# EasyEDA Pro project ProDoc_WCH-LinkW-R0-1v3_2025-07-17.epro

# Schematic WCH-LinkW-R0-1v3
Board Name: WCH-LinkW-R0-1v3; Create Date: 2025-03-27; Page Name: P1; Project Name: WCH_LINK; Schematic Name: WCH-LinkW-R0-1v2_1; Update Date: 2025-03-27; Company: 嘉立创EDA; Page Size: A3; Version: V1.0
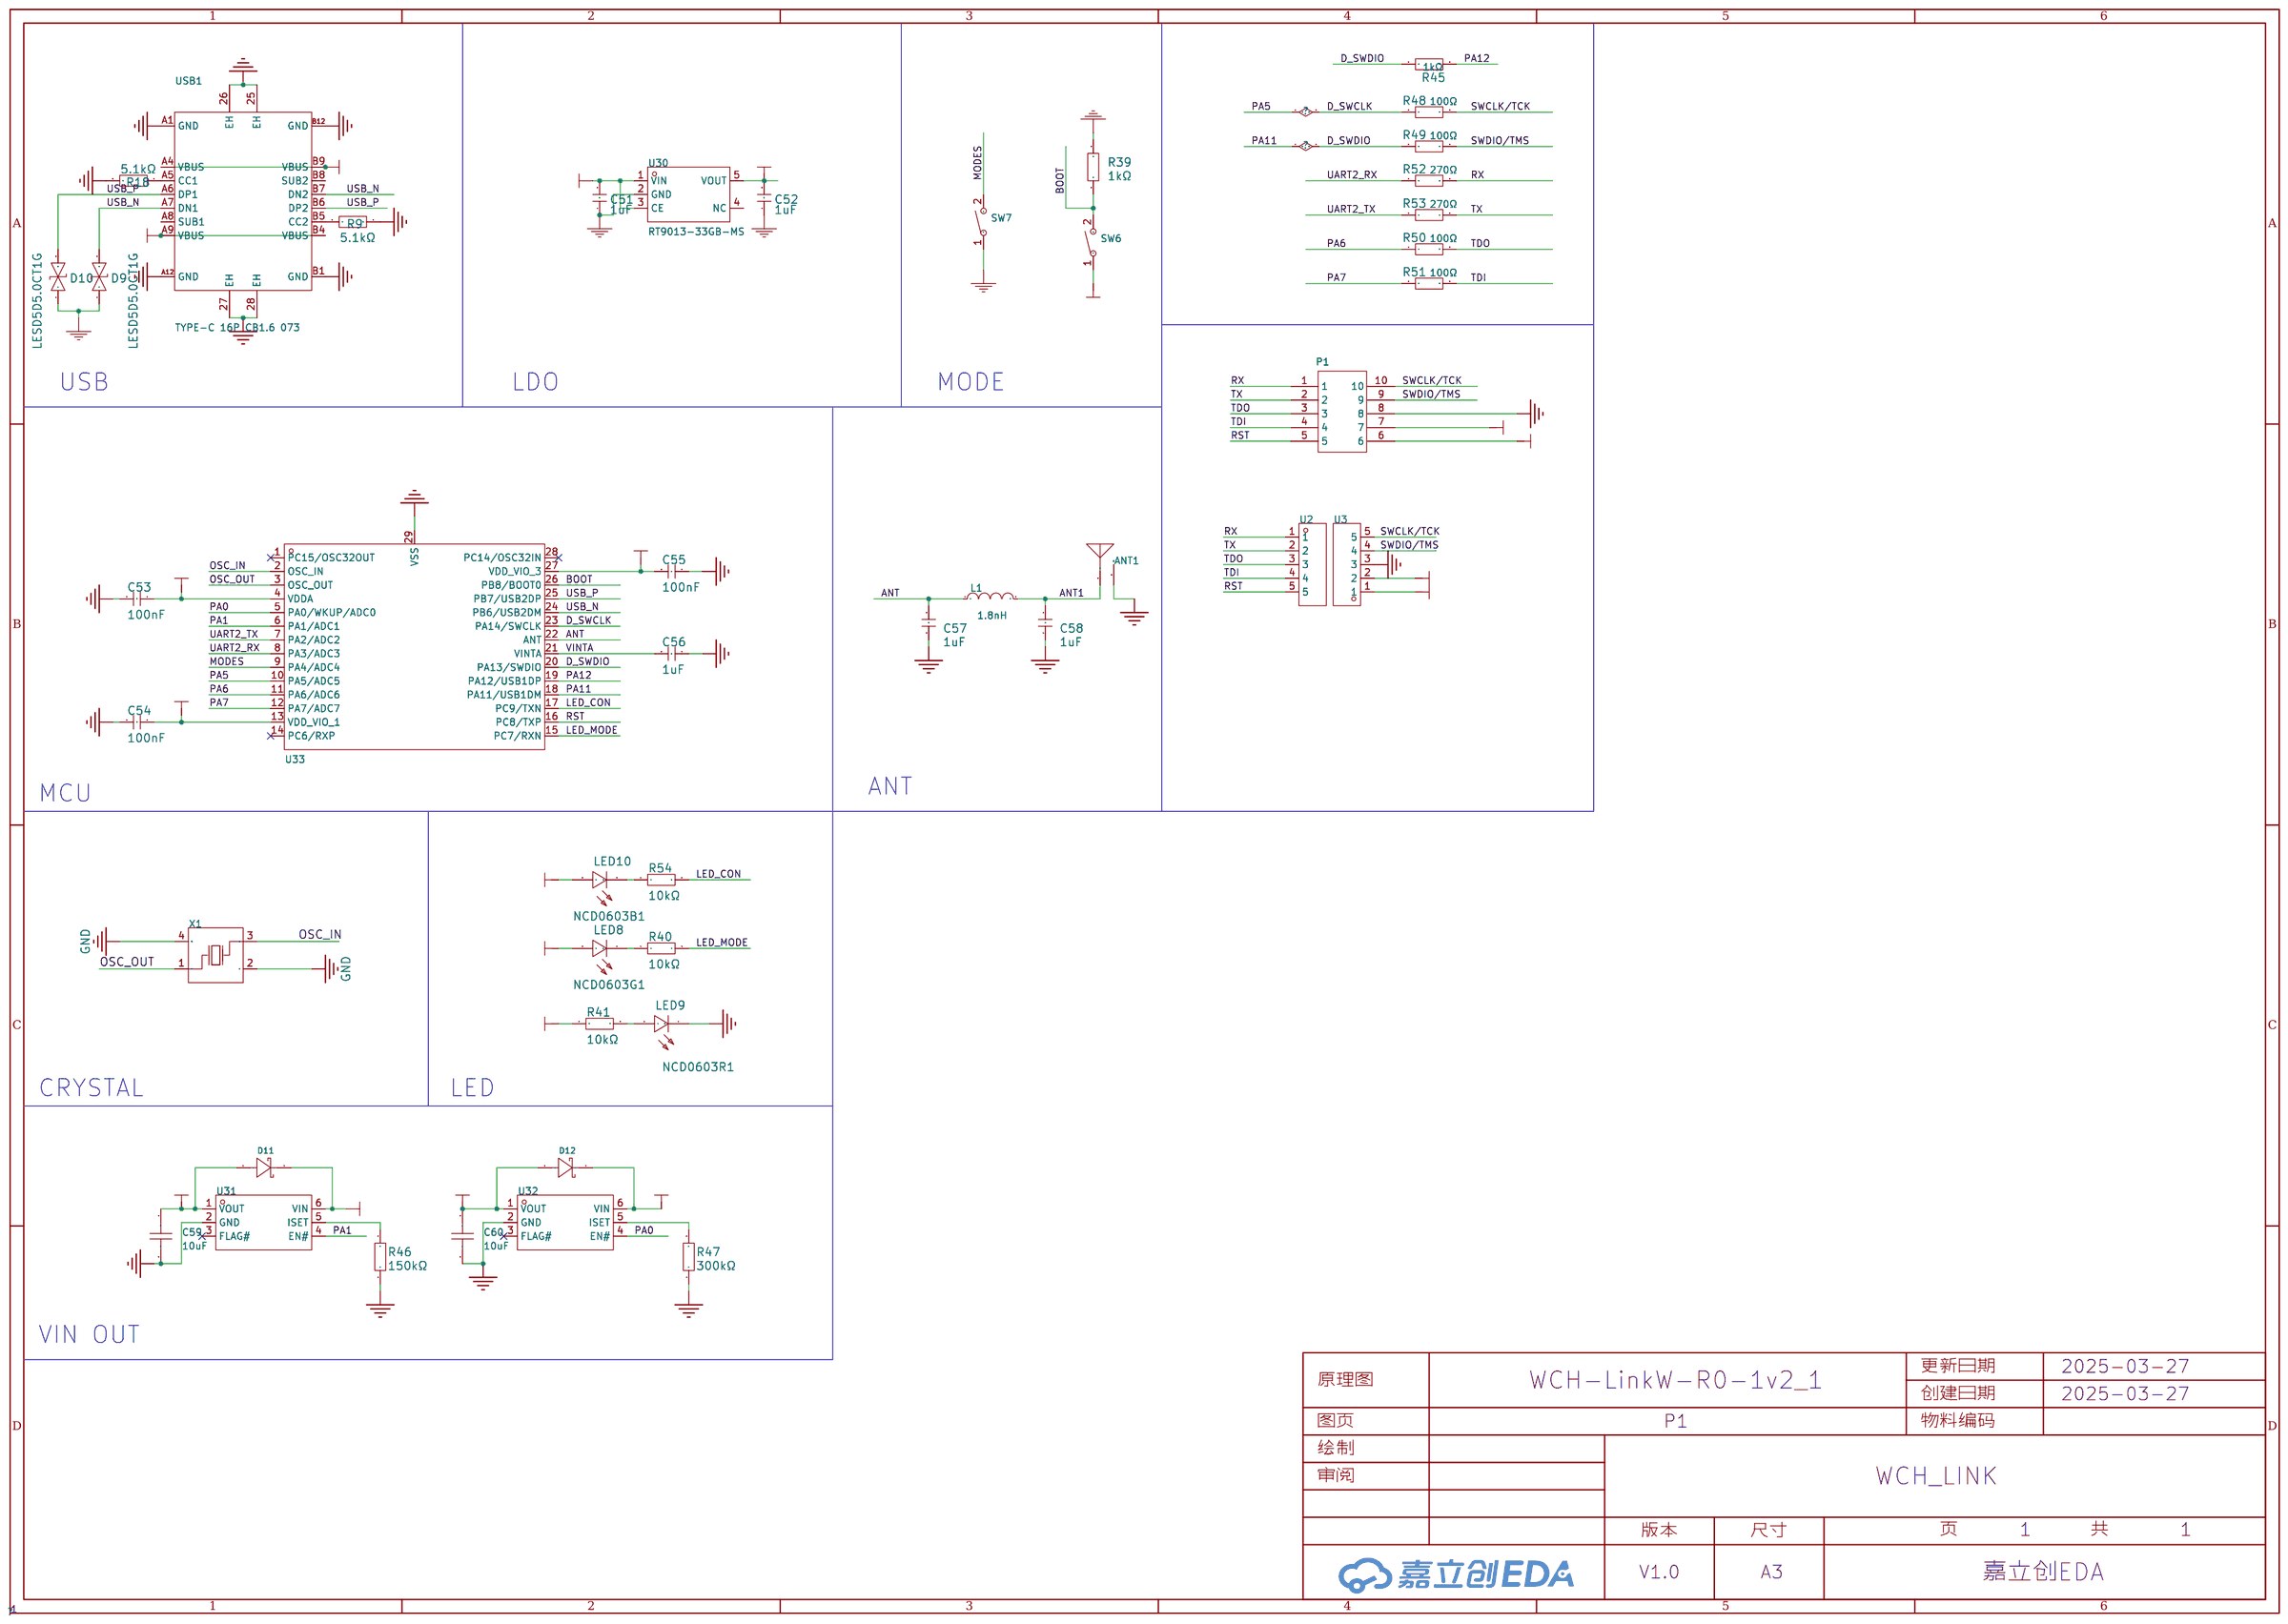
[diagram p0: schematic sheet]

## Parts
ANT1  -  [ANT-F-3-2.4G-1.6mmFR4-WCH]
C51  1uF  [C0603]
C52  1uF  [C0603]
C53  100nF  [C0603]
C54  100nF  [C0603]
C55  100nF  [C0603]
C56  1uF  [C0603]
C57  1uF  [C0603]
C58  1uF  [C0603]
C59  10uF  [C0603]  (no BOM)
C60  10uF  [C0603]  (no BOM)
D9  LESD5D5.0CT1G  [SOD-523_L1.2-W0.8-LS1.6-BI]
D10  LESD5D5.0CT1G  [SOD-523_L1.2-W0.8-LS1.6-BI]
D11  B0520WS  [SOD-323_L1.7-W1.3-LS2.6-RD-1]
D12  B0520WS  [SOD-323_L1.7-W1.3-LS2.6-RD-1]
L1  1.8nH  [IND-SMD_L1.8-W1.1]
LED8  NCD0603G1  [LED0603-RD_1]
LED9  NCD0603R1  [LED0603-RD_RED]
LED10  NCD0603B1  [LED0603-RD]
P1  -  [MZ_HDR_2.54_2*4]
R9  5.1kΩ  [R0603]
R18  5.1kΩ  [R0603]
R39  1kΩ  [R0603]
R40  10kΩ  [R0603]
R41  10kΩ  [R0603]
R45  1kΩ  [R0603]
R46  150kΩ  [R0603]
R47  300kΩ  [R0603]
R48  100Ω  [R0603]
R49  100Ω  [R0603]
R50  100Ω  [R0603]
R51  100Ω  [R0603]
R52  270Ω  [R0603]
R53  270Ω  [R0603]
R54  10kΩ  [R0603]
SW6  UK-B0273-SP25Y  [SW-SMD_L3.9-W2.9-P4.15-LS5.0]
SW7  UK-B0273-SP25Y  [SW-SMD_L3.9-W2.9-P4.15-LS5.0]
U2  X6511WVS-05H-C60D48R2  [HDR-SMD_5P-P2.54-H-M]
U3  X6511WVS-05H-C60D48R2  [HDR-SMD_5P-P2.54-H-M]
U30  RT9013-33GB-MS  [SOT-23-5_L2.9-W1.6-P0.95-LS2.8-BR]
U31  CH217K  [SOT-23-6_L2.9-W1.6-P0.95-LS2.8-BL]
U32  CH217K  [SOT-23-6_L2.9-W1.6-P0.95-LS2.8-BL]
U33  CH32V208GBU6  [QFN-28_L4.0-W4.0-P0.40-BL-EP2.8]
USB1  TYPE-C 16P CB1.6 073  [USB-C-SMD_SHOU_TYPE-C-16P-CB1.6]
X1  32MHz  [CRYSTAL-SMD_4P-L3.2-W2.5-BL]

## Library data of the parts
ANT1 = 2.4G天线
C51 C52 = CL10A105KB8NNNC: 容值:1uF;精度:±10%;额定电压:50V;材质(温度系数):X5R;; LCSC Part Name: 1uF ±10% 50V; Supplier Part: C15849; Manufacturer: SAMSUNG(三星); Supplier Footprint: 0603; JLCPCB Part Class: Basic Part; Datasheet: https://atta.szlcsc.com/upload/public/pdf/source/20160218/1457707763339.pdf; Supplier: LCSC; Tolerance: ±10%; Voltage Rated: 50V; Temperature Coefficient: X5R
C53-C55 = CGA0603X7R104K500JT: 容值:100nF;精度:±10%;额定电压:50V;温度系数:X7R;; LCSC Part Name: 100nF ±10% 50V; Supplier Part: C6119867; Manufacturer: HRE(芯声); Supplier Footprint: 0603; JLCPCB Part Class: Extended Part; Datasheet: https://atta.szlcsc.com/upload/public/pdf/source/20250103/C44077DA9E7B3EFAE02F22B6D3D1CBC9.pdf; Supplier: LCSC; Tolerance: ±10%; Voltage Rated: 50V; Temperature Coefficient: X7R; Voltage Rating: 50V
C56-C58 = CGA0603X5R105K500JT: 容值:1uF;精度:±10%;额定电压:50V;温度系数:X5R;; LCSC Part Name: 1uF ±10% 50V; Supplier Part: C6119852; Manufacturer: HRE(芯声); Supplier Footprint: 0603; JLCPCB Part Class: Extended Part; Supplier: LCSC; Tolerance: ±10%; Voltage Rating: 50V; Temperature Coefficient: X5R
C59 C60 = CL10A106MA8NRNC: 容值:10uF;精度:±20%;额定电压:25V;材质(温度系数):X5R;; LCSC Part Name: 10uF ±20% 25V; Supplier Part: C96446; Manufacturer: SAMSUNG(三星); Supplier Footprint: 0603; JLCPCB Part Class: 基础库; Datasheet: https://atta.szlcsc.com/upload/public/pdf/source/20160218/1457707763339.pdf; Supplier: LCSC; Tolerance: ±20%; Voltage Rated: 25V; Temperature Coefficient: X5R
D9 D10 = LESD5D5.0CT1G: link: https://lcsc.com/product-detail/TVS_ESD5Z5V0C_C129211.html; 3DModel: SOD-523_L1.2-W0.8-H0.7-LS1.6; Supplier: LCSC; Supplier Part: C383211; Manufacturer: Leshan Radio; JLCPCB Part Class: Extended Part
D11 D12 = B0520WS_C7502696: 二极管配置:独立式;正向压降(Vf):390mV@500mA;直流反向耐压(Vr):20V;平均整流电流(Io):500mA;; LCSC Part Name: 电压:20V 电流:500mA; Supplier Part: C7502696; Manufacturer: 宏迦橙; Supplier Footprint: SOD-323; JLCPCB Part Class: Extended Part; Datasheet: https://atta.szlcsc.com/upload/public/pdf/source/20230828/D03BBC301FC735629C9CE389FB922DA4.pdf; Supplier: LCSC; Diode Configuration: 独立式; Forward Voltage (Vf@If): 390mV@500mA; Reverse Voltage (Vr): 20V; Average Rectified Current (Io): 500mA; Reverse Leakage Current (Ir): 250uA; Peak forward surge current: 5.5A
L1 = FHW0603UC1N8KST: 电感值:1.8nH;精度:±10%;额定电流:700mA;饱和电流(Isat):-;直流电阻(DCR):45mΩ;; LCSC Part Name: 1.8nH ±10%; Supplier Part: C317979; Manufacturer: FH(风华); Supplier Footprint: 0603; JLCPCB Part Class: 扩展库; Datasheet: https://atta.szlcsc.com/upload/public/pdf/source/20230223/9A251BBDEFC1735FFD270B60AF02944E.pdf; Supplier: LCSC; Tolerance: ±10%; Rated Current: 700mA; DC Resistance (DCR): 45mΩ; Q @ Freq: 16@250MHz; Frequency - Self Resonant: 12.5GHz
LED8 = NCD0603G1: 发光颜色:翠绿色;正向压降(Vf):2.6V~3.6V;功率:72mW;正向电流:20mA;波长:515nm~530nm;透镜颜色:-;发光强度:330mcd~900mcd;发光角度:130°;工作温度:-30℃~+85℃;; Supplier Part: C84267; Manufacturer: 国星光电; Supplier Footprint: 0603; JLCPCB Part Class: Extended Part; Datasheet: https://atta.szlcsc.com/upload/public/pdf/source/20200820/C84267_04BA7703640BAC111D09F5EFB971FBF3.pdf; Supplier: LCSC; Illumination Color: 翠绿色; Voltage - Forward(Vf): 2.6V~3.6V; Power(Watts): 72mW; Forward Current: 20mA; Wavelength - Dominant: 515nm~530nm; Luminous Intensity: 330mcd~900mcd; Viewing Angle: 130°; Operating Temperature: -30℃~+85℃
LED9 = NCD0603R1_C84263: 灯头类型:-;发光颜色:红色;正向压降(Vf):1.6V~2.6V;功率:65mW;正向电流:25mA;波长:615nm~630nm;二极管配置:独立二极管;透镜颜色:-;色温:-;发光强度:80mcd~220mcd;发光角度:130°;载带方式:-;工作温度:-30℃~+85℃;; Supplier Part: C84263; Manufacturer: 国星光电; Supplier Footprint: 0603; JLCPCB Part Class: Extended Part; Datasheet: https://atta.szlcsc.com/upload/public/pdf/source/20200820/C84263_DABC6A75E58F576973B407FDBA283D60.pdf; Supplier: LCSC; Illumination Color: 红色; Voltage - Forward(Vf): 1.6V~2.6V; Power(Watts): 65mW; Forward Current: 25mA; Wavelength - Dominant: 615nm~630nm; Diode Configuration: 独立二极管; Luminous Intensity: 80mcd~220mcd; Viewing Angle: 130°; Operating Temperature: -30℃~+85℃
LED10 = NCD0603B1: 发光颜色:蓝色;正向电压(VF):2.6V~3.6V;功率:72mW;正向电流:10mA;主波长:463nm~475nm;透镜颜色:无色透明透镜;发光强度:80mcd~220mcd;发光角度:130°;工作温度:-30℃~+85℃;; Supplier Part: C84266; Manufacturer: 国星光电; Supplier Footprint: 0603; JLCPCB Part Class: Extended Part; Datasheet: https://atta.szlcsc.com/upload/public/pdf/source/20200820/C84266_6A3CDBEFA72C6CAD68EDA53474ADAE6C.pdf; Supplier: LCSC; Emitted Color: 蓝色; Forward Voltage (VF): 2.6V~3.6V; Power Dissipation: 72mW; Forward Current: 10mA; Dominant Wavelength: 463nm~475nm; Lens Color: 无色透明透镜; Luminous Intensity: 80mcd~220mcd; Viewing Angle: 130°; Operating Temperature: -30℃~+85℃
P1 = 2*5P 排针夹板 2.54
R9 R18 = 0603WAF5101T5E: 电阻类型:厚膜电阻;阻值:5.1kΩ;精度:±1%;功率:100mW;最大工作电压:75V;温度系数:±100ppm/℃;; LCSC Part Name: 5.1kΩ ±1% 100mW 厚膜电阻; Supplier Part: C23186; Manufacturer: UNI-ROYAL(厚声); Supplier Footprint: 0603; JLCPCB Part Class: Basic Part; Datasheet: https://atta.szlcsc.com/upload/public/pdf/source/20200306/C422600_1E6D84923E4A46A82E41ADD87F860B5C.pdf; Supplier: LCSC; Type: 厚膜电阻; Tolerance: ±1%; Power(Watts): 100mW; Overload Voltage (Max): 75V; Temperature Coefficient: ±100ppm/℃; Operating Temperature Range: -55℃~+155℃
R39 = 0603WAF1001T5E: 电阻类型:厚膜电阻;阻值:1kΩ;精度:±1%;功率:100mW;最大工作电压:75V;温度系数:±100ppm/℃;; LCSC Part Name: 1kΩ ±1% 100mW 厚膜电阻; Supplier Part: C21190; Manufacturer: UNI-ROYAL(厚声); Supplier Footprint: 0603; JLCPCB Part Class: Basic Part; Datasheet: https://atta.szlcsc.com/upload/public/pdf/source/20200306/C422600_1E6D84923E4A46A82E41ADD87F860B5C.pdf; Supplier: LCSC; Type: 厚膜电阻; Tolerance: ±1%; Power(Watts): 100mW; Overload Voltage (Max): 75V; Temperature Coefficient: ±100ppm/℃; Operating Temperature Range: -55℃~+155℃
R40 R41 R54 = 0603WAF1002T5E: 电阻类型:厚膜电阻;阻值:10kΩ;精度:±1%;功率:100mW;最大工作电压:75V;温度系数:±100ppm/℃;; LCSC Part Name: 厚膜电阻 10kΩ ±1% 100mW; Supplier Part: C25804; Manufacturer: UNI-ROYAL(厚声); Supplier Footprint: 0603; JLCPCB Part Class: Basic Part; Datasheet: https://atta.szlcsc.com/upload/public/pdf/source/20200306/C422600_1E6D84923E4A46A82E41ADD87F860B5C.pdf; Supplier: LCSC; Type: 厚膜电阻; Tolerance: ±1%; Power(Watts): 100mW; Overload Voltage (Max): 75V; Temperature Coefficient: ±100ppm/℃; Operating Temperature Range: -55℃~+155℃
R45 = 0603WAF1001T5E: 电阻类型:厚膜电阻;阻值:1kΩ;精度:±1%;功率:100mW;最大工作电压:75V;温度系数:±100ppm/℃;; LCSC Part Name: 1kΩ ±1% 100mW 厚膜电阻; Supplier Part: C21190; Manufacturer: UNI-ROYAL(厚声); Supplier Footprint: 0603; JLCPCB Part Class: 基础库; Datasheet: https://atta.szlcsc.com/upload/public/pdf/source/20200306/C422600_1E6D84923E4A46A82E41ADD87F860B5C.pdf; Supplier: LCSC; Type: 厚膜电阻; Tolerance: ±1%; Power(Watts): 100mW; Overload Voltage (Max): 75V; Temperature Coefficient: ±100ppm/℃; Operating Temperature Range: -55℃~+155℃
R46 = 0603WAF1503T5E: 电阻类型:厚膜电阻;阻值:150kΩ;精度:±1%;功率:100mW;最大工作电压:75V;温度系数:±100ppm/℃;; LCSC Part Name: 150kΩ ±1% 100mW 厚膜电阻; Supplier Part: C22807; Manufacturer: UNI-ROYAL(厚声); Supplier Footprint: 0603; JLCPCB Part Class: 基础库; Datasheet: https://atta.szlcsc.com/upload/public/pdf/source/20200306/C422600_1E6D84923E4A46A82E41ADD87F860B5C.pdf; Supplier: LCSC; Type: 厚膜电阻; Tolerance: ±1%; Power(Watts): 100mW; Overload Voltage (Max): 75V; Temperature Coefficient: ±100ppm/℃; Operating Temperature Range: -55℃~+155℃
R47 = 0603WAF3003T5E: 电阻类型:厚膜电阻;阻值:300kΩ;精度:±1%;功率:100mW;最大工作电压:75V;温度系数:±100ppm/℃;; LCSC Part Name: 300kΩ ±1% 100mW 厚膜电阻; Supplier Part: C23024; Manufacturer: UNI-ROYAL(厚声); Supplier Footprint: 0603; JLCPCB Part Class: 基础库; Datasheet: https://atta.szlcsc.com/upload/public/pdf/source/20200306/C422600_1E6D84923E4A46A82E41ADD87F860B5C.pdf; Supplier: LCSC; Type: 厚膜电阻; Tolerance: ±1%; Power(Watts): 100mW; Overload Voltage (Max): 75V; Temperature Coefficient: ±100ppm/℃; Operating Temperature Range: -55℃~+155℃
R48-R51 = 0603WAF1000T5E: 电阻类型:厚膜电阻;阻值:100Ω;精度:±1%;功率:100mW;最大工作电压:75V;温度系数:±200ppm/℃;; LCSC Part Name: 100Ω ±1% 100mW 厚膜电阻; Supplier Part: C22775; Manufacturer: UNI-ROYAL(厚声); Supplier Footprint: 0603; JLCPCB Part Class: Basic Part; Datasheet: https://atta.szlcsc.com/upload/public/pdf/source/20200306/C422600_1E6D84923E4A46A82E41ADD87F860B5C.pdf; Supplier: LCSC; Type: 厚膜电阻; Tolerance: ±1%; Power(Watts): 100mW; Overload Voltage (Max): 75V; Temperature Coefficient: ±200ppm/℃; Operating Temperature Range: -55℃~+155℃
R52 R53 = 0603WAF2700T5E: 电阻类型:厚膜电阻;阻值:270Ω;精度:±1%;功率:100mW;最大工作电压:75V;温度系数:±100ppm/℃;; LCSC Part Name: 270Ω ±1% 100mW 厚膜电阻; Supplier Part: C22966; Manufacturer: UNI-ROYAL(厚声); Supplier Footprint: 0603; JLCPCB Part Class: 基础库; Datasheet: https://atta.szlcsc.com/upload/public/pdf/source/20200306/C422600_1E6D84923E4A46A82E41ADD87F860B5C.pdf; Supplier: LCSC; Type: 厚膜电阻; Tolerance: ±1%; Power(Watts): 100mW; Overload Voltage (Max): 75V; Temperature Coefficient: ±100ppm/℃; Operating Temperature Range: -55℃~+155℃
SW6 SW7 = UK-B0273-SP25Y: 触点电流:50mA;额定电压(AC):-;额定电压(DC):12V;额定功率:-;绝缘电阻:100MΩ;电路结构:单刀单掷;安装方式:立贴;带灯:无;作用力:250gf@±30gf;机械寿命:10万次;带支架:否;; LCSC Part Name: 3.9*2.9*2mm 立贴 轻触开关; Supplier Part: C493285; Manufacturer: USAKRO(美韩); Supplier Footprint: SMD; JLCPCB Part Class: 扩展库; Datasheet: https://atta.szlcsc.com/upload/public/pdf/source/20200316/C493285_638365E99AEC68F39349AA5AE0196036.pdf; Supplier: LCSC; Contact Current: 50mA; Voltage Rating (DC): 12V; Insulation Resistance: 100MΩ; Circuit: 单刀单掷; Mounting Style: 立贴; Actuator Style: 圆形按钮; Actuator/Cap Color: 黑色; With Lamp: 无; Operating Force: 250gf@±30gf; Mechanical Life: 10万次; Operating Temperature: -20℃~+70℃; Pin Style: SMD接片; Switch Length: 3.9mm; Switch Width: 2.9mm; Switch Height: 2mm; Strike Gundam: 否
U2 U3 = X6511WVS-05H-C60D48R2: 插针结构:1x5P;间距:2.54mm;行距:2.54mm;圆针/方针:方针;安装类型:-;排数:单排;总PIN位数:5P;额定电流:3A;额定电压:250V;配合针长度:-;塑高:2.5mm;端接针长度:-;触头材质:黄铜;触头镀层:金;工作温度范围:-40℃~+105℃;焊接温度(最大值):260℃;颜色:黑色;; LCSC Part Name: 1x5P 间距:2.54mm 方针; Supplier Part: C2883762; Manufacturer: XKB Connection(中国星坤); Supplier Footprint: SMD,P=2.54mm; JLCPCB Part Class: 扩展库; Datasheet: https://atta.szlcsc.com/upload/public/pdf/source/20200909/C780060_F941EB1B69F43B5D6329EAF74E2E27BB.pdf; Supplier: LCSC; Pin Structure: 1x5P; Pitch: 2.54mm; Row Spacing: 2.54mm; Circluar Pins/Square Pins: 方针; Number of Rows: 单排; Number of Pins: 5P; Current Rating (Max): 3A; Voltage Rating (Max): 250V; Insulation Height: 2.5mm; Contact Material: 黄铜; Contact Plating: 金; Operating Temperature Range: -40℃~+105℃; Soldering Temperature(Max): 260℃; Color: 黑色
U30 = RT9013-33GB-MS: 输出类型:固定;最大输入电压:5.5V;输出电压:3.3V;最大输出电流:500mA;电源纹波抑制比(PSRR):75dB@(1kHz);输出极性:正极;; Supplier Part: C7434207; Manufacturer: MSKSEMI(美森科); Supplier Footprint: SOT-23-5; JLCPCB Part Class: Extended Part; Datasheet: https://atta.szlcsc.com/upload/public/pdf/source/20230705/1D6536D82D93AC1E044F3DAE104751D9.pdf; Supplier: LCSC; Output Type: 固定; Maximum Input Voltage: 5.5V; Output Voltage: 3.3V; MAX Output Current: 500mA; Power Supply Rejection Ratio (PSRR): 75dB@(1kHz); Output Polarity: 正极
U31 U32 = CH217K: Supplier Part: C7462749; Supplier Footprint: SOT-23-6; JLCPCB Part Class: 扩展库; Supplier: LCSC
U33 = CH32V208GBU6: Supplier Part: C7434833; Manufacturer: WCH(南京沁恒); Supplier Footprint: QFN-28-EP(4x4); JLCPCB Part Class: 扩展库; Datasheet: https://atta.szlcsc.com/upload/public/pdf/source/20240411/5E05523CBB231C22A5C78C078317BD2C.pdf; Supplier: LCSC
USB1 = TYPE-C 16P CB1.6 073: 连接器类型:Type-C;标准:-;公母:母;端口数量:1;触点数量:16P;安装方式:沉板;额定电流 - 电源:3A;工作温度范围:-25℃~+85℃;; LCSC Part Name: Type-C 母 沉板; Supplier Part: C2906290; Manufacturer: SHOU HAN(首韩); Supplier Footprint: SMD; JLCPCB Part Class: Extended Part; Datasheet: https://atta.szlcsc.com/upload/public/pdf/source/20211021/35D048B933FA988260DD32545575C1A5.pdf; Supplier: LCSC; Connector Type: Type-C; Gender: 母; Number of Ports: 1; Number of Contacts: 16P; Mounting Style: 沉板; Current Rating - Power (Max): 3A; Operating Temperature Range: -25℃~+85℃
X1 = X322532MOB4SI: 晶振类型:贴片晶振;频率:32MHz;常温频差:±10ppm;外接负载电容:12pF;频率稳定度(全温):±20ppm;; LCSC Part Name: 32MHz ±10ppm 12pF; Supplier Part: C9009; Manufacturer: YXC(扬兴晶振); Supplier Footprint: SMD3225-4P; JLCPCB Part Class: 扩展库; Datasheet: https://atta.szlcsc.com/upload/public/pdf/source/20240329/19D5F850207469550BEB00D7DFEDBC7A.pdf; Supplier: LCSC; Crystal Type: 贴片晶振; Normal temperature Frequency Tolerance: ±10ppm; External load capacitor: 12pF; Frequency Stability(Full temperature range): ±20ppm; Operating Temperature: -40℃~+85℃

## Nets
3V3: C60.1 D12.2(A) P1.7 U3.2 U32.1(VOUT)
3V3_IN: C52.2 C53.1 C54.1 C55.2 D12.1(K) LED8.2(A) LED10.2(A) R41.1 SW6.1 U30.5(VOUT) U32.6(VIN) U33.4(VDDA) U33.13(VDD_VIO_1) U33.27(VDD_VIO_3)
5V: C59.1 D11.2(A) P1.6 U3.1 U31.1(VOUT)
GND: ANT1.0(GND) C51.1 C52.1 C53.2 C54.2 C55.1 C56.1 C57.2 C58.2 C59.2 C60.2 D9.1 D10.1 LED9.1(C) P1.8 R9.1 R18.2 R39.2 R46.1 R47.1 SW7.1 U3.3 U30.2(GND) U31.2(GND) U32.2(GND) U33.29(VSS) USB1.25(EH) USB1.26(EH) USB1.27(EH) USB1.28(EH) USB1.A1(GND) USB1.A12(GND) USB1.B1(GND) USB1.B12(GND) X1.2(GND) X1.4(GND)
VBUS: C51.2 D11.1(K) U30.1(VIN) U30.3(CE) U31.6(VIN) USB1.A4(VBUS) USB1.A9(VBUS) USB1.B4(VBUS) USB1.B9(VBUS)
VINTA: C56.2 U33.21(VINTA)
ANT: C57.1 L1.1 U33.22(ANT)
ANT1: ANT1.1(ANT) C58.1 L1.2
BOOT: R39.1 SW6.2 U33.26(PB8/BOOT0)
D_SWCLK: R48.1 U33.10(PA5/ADC5) U33.23(PA14/SWCLK)
D_SWDIO: R45.1 R49.1 U33.18(PA11/USB1DM) U33.20(PA13/SWDIO)
LED_CON: R54.2 U33.17(PC9/TXN)
LED_MODE: R40.2 U33.15(PC7/RXN)
MODES: SW7.2 U33.9(PA4/ADC4)
OSC_IN: U33.2(OSC_IN) X1.3(OSC2)
OSC_OUT: U33.3(OSC_OUT) X1.1(OSC1)
PA0: U32.4(EN#) U33.5(PA0/WKUP/ADC0)
PA1: U31.4(EN#) U33.6(PA1/ADC1)
PA6: R50.1 U33.11(PA6/ADC6)
PA7: R51.1 U33.12(PA7/ADC7)
PA12: R45.2 U33.19(PA12/USB1DP)
RST: P1.5 U2.5 U33.16(PC8/TXP)
RX: P1.1 R52.2 U2.1
SWCLK/TCK: P1.10 R48.2 U3.5
SWDIO/TMS: P1.9 R49.2 U3.4
TDI: P1.4 R51.2 U2.4
TDO: P1.3 R50.2 U2.3
TX: P1.2 R53.2 U2.2
UART2_RX: R52.1 U33.8(PA3/ADC3)
UART2_TX: R53.1 U33.7(PA2/ADC2)
USB_N: D9.2 U33.24(PB6/USB2DM) USB1.A7(DN1) USB1.B7(DN2)
USB_P: D10.2 U33.25(PB7/USB2DP) USB1.A6(DP1) USB1.B6(DP2)
$1N1782: LED8.1(C) R40.1
$1N1786: LED9.2(A) R41.2
$1N1849: R46.2 U31.5(ISET)
$1N1850: R47.2 U32.5(ISET)
$1N2678: LED10.1(C) R54.1
$1N9716: R9.2 USB1.B5(CC2)
$1N9721: R18.1 USB1.A5(CC1)

Not connected (* = marked no-connect by the designer): U30 4(NC); U31 3(FLAG#)*; U32 3(FLAG#)*; U33 1(PC15/OSC32OUT)* 14(PC6/RXP)* 28(PC14/OSC32IN)*; USB1 A8(SUB1) B8(SUB2)

## Notes on the sheet
- USB
- LDO
- MODE
- MCU
- ANT
- CRYSTAL
- LED
- VIN OUT

# Board WCH-LinkW-R0-1v3
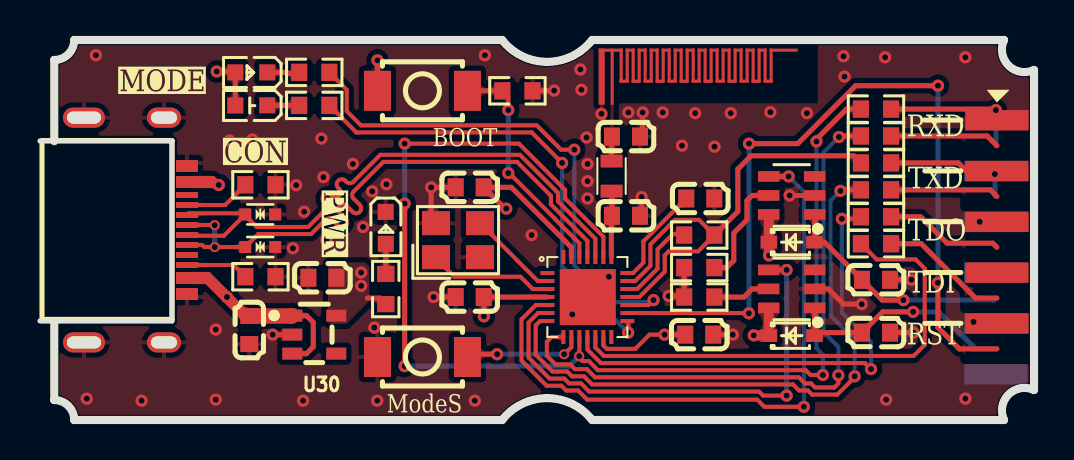
[diagram p1: board, top side]
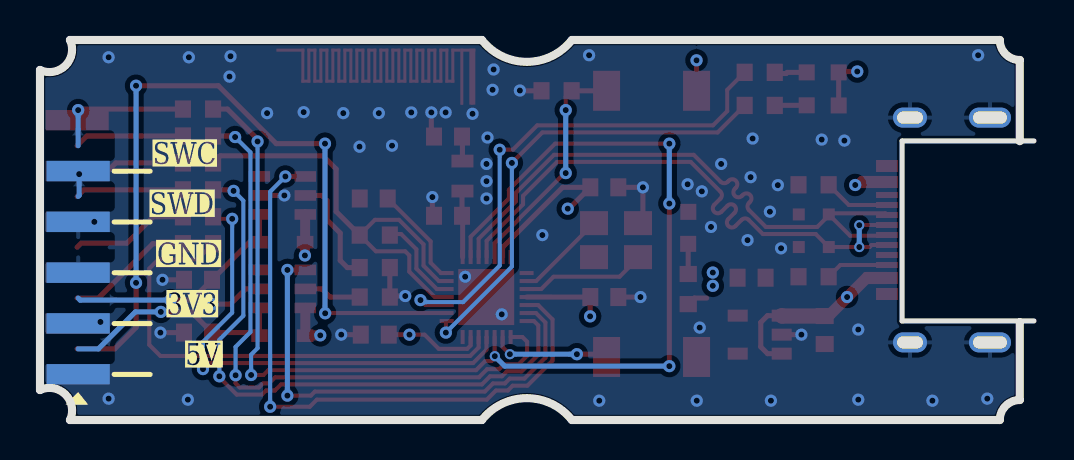
[diagram p2: board, bottom side, seen from below]

Outline 49.71 x 19 mm; copper layers: Top Layer, Inner1, Inner2, Bottom Layer. Coordinates in mm from the lower left corner of the outline.
Outline path: 0.71,13.94 0.71,18 arc(1.42,18.29) 1.71,19 23.11,19 arc(25.36,17.91) 27.61,19 48.21,19 arc(48.44,17.72) 49.71,17.5 49.71,1.5 arc(48.44,1.28) 48.21,0 27.61,0 arc(25.36,1.09) 23.11,0 1.71,0 arc(1.42,0.71) 0.71,1 0.71,4.9
Stack: Top Layer 0.035mm 外层铜厚1oz / Dielectric1 0.2104mm 7628 RC49% 8.6mil / Inner1 0.0152mm 内层铜厚 / Dielectric2 1.065mm 1.1mm H/HOZ Copper / Inner2 0.0152mm 内层铜厚 / Dielectric3 0.2104mm 7628 RC49% 8.6mil / Bottom Layer 0.035mm 外层铜厚1oz

## Design rules (mm)
template: 自定义配置
spacing copperThickness1oz (default): track to track 0.152, other pairs 0.051 to 0.3
spacing copperThickness2oz: track to track 0.203, other pairs 0.152 to 0.3
track width copperThickness1oz (default): min 0.127, default 0.254, max 2.54
track width copperThickness2oz: min 0.203, default 0.254, max 2.54
differential pair differentialPair (default): width min 0.127, default 0.254, max 2.54; gap min 0.152, default 0.152
via viaSize (default): diameter min 0.5, default 0.61, max 10; hole min 0.3, default 0.305, max 6.299

## Placement (name value [footprint] x y rotation side)
ANT1  -  [ANT-F-3-2.4G-1.6mmFR4-WCH]  28.62 15.82 0 top
C51  1uF  [C0603]  10.47 4.5 90 top
C52  1uF  [C0603]  21.49 11.63 0 top
C53  100nF  [C0603]  21.49 6.15 180 top
C54  100nF  [C0603]  14.12 7.11 180 top
C55  100nF  [C0603]  32.97 4.27 180 top
C56  1uF  [C0603]  33.02 11.08 180 top
C57  1uF  [C0603]  29.31 10.21 0 top
C58  1uF  [C0603]  29.31 14.17 0 top
C59  10uF  [C0603]  41.81 4.37 0 top
C60  10uF  [C0603]  41.81 7.01 0 top
D9  LESD5D5.0CT1G  [SOD-523_L1.2-W0.8-LS1.6-BI]  11.01 10.28 180 top
D10  LESD5D5.0CT1G  [SOD-523_L1.2-W0.8-LS1.6-BI]  11.01 8.65 180 top
D11  B0520WS  [SOD-323_L1.7-W1.3-LS2.6-RD-1]  37.59 4.22 0 top
D12  B0520WS  [SOD-323_L1.7-W1.3-LS2.6-RD-1]  37.59 8.89 0 top
L1  1.8nH  [IND-SMD_L1.8-W1.1]  28.58 12.2 90 top
LED8  NCD0603G1  [LED0603-RD_1]  10.57 15.73 180 top
LED9  NCD0603R1  [LED0603-RD_RED]  17.29 9.61 270 top
LED10  NCD0603B1  [LED0603-RD]  10.57 17.38 180 top
R9  5.1kΩ  [R0603]  11.02 7.16 180 top
R18  5.1kΩ  [R0603]  11.02 11.76 0 top
R39  1kΩ  [R0603]  23.88 16.46 0 top
R40  10kΩ  [R0603]  13.72 15.73 0 top
R41  10kΩ  [R0603]  17.29 6.55 90 top
R45  1kΩ  [R0603]  32.97 9.25 180 top
R46  150kΩ  [R0603]  32.97 6.15 0 top
R47  300kΩ  [R0603]  32.97 7.62 0 top
R48  100Ω  [R0603]  41.81 15.55 0 top
R49  100Ω  [R0603]  41.81 12.85 0 top
R50  100Ω  [R0603]  41.81 10.16 0 top
R51  100Ω  [R0603]  41.81 8.81 0 top
R52  270Ω  [R0603]  41.81 14.2 0 top
R53  270Ω  [R0603]  41.81 11.51 0 top
R54  10kΩ  [R0603]  13.72 17.38 0 top
SW6  UK-B0273-SP25Y  [SW-SMD_L3.9-W2.9-P4.15-LS5.0]  19.13 16.46 0 top
SW7  UK-B0273-SP25Y  [SW-SMD_L3.9-W2.9-P4.15-LS5.0]  19.13 3.15 0 top
U2  X6511WVS-05H-C60D48R2  [HDR-SMD_5P-P2.54-H-M]  47.85 8.64 270 top
U3  X6511WVS-05H-C60D48R2  [HDR-SMD_5P-P2.54-H-M]  47.8 8.64 90 bottom
U30  RT9013-33GB-MS  [SOT-23-5_L2.9-W1.6-P0.95-LS2.8-BR]  13.72 4.27 180 top
U31  CH217K  [SOT-23-6_L2.9-W1.6-P0.95-LS2.8-BL]  37.59 6.55 90 top
U32  CH217K  [SOT-23-6_L2.9-W1.6-P0.95-LS2.8-BL]  37.59 11.23 90 top
U33  CH32V208GBU6  [QFN-28_L4.0-W4.0-P0.40-BL-EP2.8]  27.38 6.15 270 top
USB1  TYPE-C 16P CB1.6 073  [USB-C-SMD_SHOU_TYPE-C-16P-CB1.6]  4.78 9.5 270 top
X1  32MHz  [CRYSTAL-SMD_4P-L3.2-W2.5-BL]  20.91 8.99 0 top

## Footprints (pads in the part's own frame, mm; a bottom-side part is the same pattern mirrored in y, then rotated)
ANT-F-3-2.4G-1.6mmFR4-WCH
  rect 0.1x0.1 smd: 0(-0.525,0) 1(0,0)
C0603
  rect 0.8x0.9 smd: 1(-0.7,0) 2(0.7,0)
CRYSTAL-SMD_4P-L3.2-W2.5-BL
  rect 1.4x1.2 smd: 1(-1.1,-0.85) 2(1.1,-0.85) 3(1.1,0.85) 4(-1.1,0.85)
HDR-SMD_5P-P2.54-H-M
  rect 1.02x3.16 smd: 1(-6.35,0) 2(-3.81,0) 3(-1.27,0) 4(1.27,0) 5(3.81,0)
IND-SMD_L1.8-W1.1
  rect 0.64x1.1 smd: 1(-0.75,0) 2(0.75,0)
LED0603-RD
  rect 0.8x0.8 smd: 1(-0.799,0) 2(0.799,0)
LED0603-RD_1
  rect 0.8x0.8 smd: 1(-0.799,-0.004) 2(0.799,0.004)
LED0603-RD_RED
  rect 0.8x0.8 smd: 1(-0.799,-0.004) 2(0.799,0.004)
QFN-28_L4.0-W4.0-P0.40-BL-EP2.8
  rect 0.2x0.7 smd: 1(-1.2,-2) 2(-0.8,-2) 3(-0.4,-2) 4(-0.001,-2) 5(0.4,-2) 6(0.8,-2) 7(1.2,-2) 15(1.2,2) 16(0.8,2) 17(0.4,2) 18(0,2) 19(-0.4,2) 20(-0.8,2) 21(-1.2,2)
  rect 0.7x0.2 smd: 8(2,-1.2) 9(2,-0.8) 10(2,-0.4) 11(1.999,0) 12(2,0.4) 13(2,0.8) 14(2,1.2) 22(-2,1.2) 23(-2,0.8) 24(-2,0.4) 25(-2,0) 26(-2,-0.4) 27(-2,-0.8) 28(-2,-1.2)
  rect 2.8x2.8 smd: 29(0.001,0.02)
R0603
  rect 0.806x0.864 smd: 1(-0.753,0) 2(0.753,0)
SOD-323_L1.7-W1.3-LS2.6-RD-1
  rect 0.83x0.63 smd: 1(-1.14,0) 2(1.14,0)
SOD-523_L1.2-W0.8-LS1.6-BI
  rect 0.6x0.6 smd: 1(-0.75,0) 2(0.75,0)
SOT-23-5_L2.9-W1.6-P0.95-LS2.8-BR
  rect 1x0.6 smd: 1(1.1,-0.95) 2(1.1,0) 3(1.1,0.95) 4(-1.1,0.95) 5(-1.1,-0.95)
SOT-23-6_L2.9-W1.6-P0.95-LS2.8-BL
  rect 0.532x1.072 smd: 1(-0.95,-1.149) 2(0,-1.149) 3(0.95,-1.149) 4(0.95,1.149) 5(0,1.149) 6(-0.95,1.149)
SW-SMD_L3.9-W2.9-P4.15-LS5.0
  rect 1.35x2 smd: 1(-2.25,0) 2(2.25,0)
USB-C-SMD_SHOU_TYPE-C-16P-CB1.6
  oval 1x1.7 hole 0.6x1.3: 25(5.62,1.425) 28(-5.62,1.425)
  oval 1x2.1 hole 0.6x1.7: 26(5.62,-2.575) 27(-5.62,-2.575)
  rect 0.3x1.1 smd: A1(-3.35,2.575) A4(-2.55,2.575) A5(-1.25,2.575) A6(-0.25,2.575) A7(0.25,2.575) A8(1.25,2.575) A9(2.55,2.575) A12(3.35,2.575) B1(3.05,2.575) B4(2.25,2.575) B5(1.75,2.575) B6(0.75,2.575) B7(-0.75,2.575) B8(-1.75,2.575) B9(-2.25,2.575) B12(-3.05,2.575)

## Nets
As in the schematic.

Pads without a net: U30 4; U31 3; U32 3; U33 1 14 28; USB1 A8 B8

## Via types
v1: diameter 0.61, hole 0.305, Top Layer to Bottom Layer, 101 vias
v2: diameter 0.508, hole 0.305, Top Layer to Bottom Layer, 4 vias

## Routing (per net, layer and track width the routed paths; a pad name or vN(x,y) marks a point on that pad's centre or on a via; arc(x,y) is an arc through that point)
3V3: length 11.7
  Top Layer w0.254: v1(43.18,6) 42.13,6 41.11,7.01 39.23,8.89 D12.2 38.74,8.9 U32.1
  Bottom Layer w0.254: v1(43.18,6) 47.7,6 47.8,6.1
3V3_IN: length 24
  Top Layer w0.203: U33.13 28.18,3.73 28.35,3.56 29.77,3.56 30.48,4.27 v1(31.24,4.27)
  Top Layer w0.254: C55.2 v1(31.24,4.27) ; v1(22.2,5.18) 22.2,6.14 C53.1 U33.4 ; v1(8.84,17.42) 9.72,17.42 9.77,17.38 9.77,15.73 ; U33.27 26.58,8.63 23.57,11.63 C52.2 23.26,10.57 v1(23.32,10.57) ; SW6.1 v1(16.88,17.98) ; 16.37,6.1 16.99,6.1 R41.1
  Top Layer w0.5: U32.6 36.45,10.27 D12.1 36.46,8.88 v1(36.46,8.23)
  vias: v1(16.06,7.37) v1(16.06,6.71)
5V: length 11.7
  Top Layer w0.254: v1(43.67,5.41) 42.14,5.41 41.11,4.37 38.89,4.37 38.74,4.23 ; U31.1 38.74,4.23 ; 38.74,4.23 D11.2
  Bottom Layer w0.254: 47.8,3.56 46.79,3.56 44.94,5.41 v1(43.67,5.41)
GND: length 17.9
  Top Layer w0.254: U31.2 39.42,6.55 40.18,5.79 v1(41.1,5.79) ; v1(30.09,11.15) 30.09,10.29 C57.2 ; R47.1 R46.1 32.17,6.2 v1(31.45,6.2) ; C60.2 v1(43.59,7.01) ; C53.2 v1(19.68,6.15) ; C55.1 v1(34.65,4.27) ; U30.2 v1(11.63,4.27) ; 20.79,11.63 v1(19.56,11.63) 19.56,10.09 19.8,9.84 ; R39.2 25.7,16.46 v1(25.71,16.47) ; U32.2 v1(37.49,11.23) ; C58.2 30.14,14.31 v1(30.14,15.38) ; C59.2 v1(43.69,4.37)
  vias: v1(2.34,1.07) v1(2.8,18.24) v1(5.08,0.97) v1(8.79,4.52) v1(8.79,1.02) v1(9.48,13.97) v1(10.62,14.02) v1(12.65,8.59) v1(12.81,11.74) v1(13.16,0.97) v1(13.21,10.42) v1(14.07,14.07) v1(14.17,12.14) v1(14.33,8.99) v1(15.65,12.8) v1(16.16,9.65) v1(16.61,11.43) v1(16.72,4.62) v1(16.87,0.97) v1(17.32,11.79) v1(21.74,0.97) v1(22.25,18.24) v1(24.59,9.25) v1(26.62,5.28) v1(27.03,17.53) v1(27.08,16.51) v1(27.33,14.12) v1(27.38,12.8) v1(27.38,11.94) v1(27.38,11.08) v1(28.08,15.31) v1(28.45,7.16) v1(29.43,15.38) v1(31.14,15.38) v1(32.11,13.72) v1(32.77,15.34) v1(33.73,13.67) v1(34.55,15.34) v1(36.53,15.39) v1(38.36,15.34) v1(40.18,18.19) v1(40.23,17.17) v1(42.27,18.14) v1(42.32,1.02) v1(46.28,18.14) v1(46.28,1.07) v1(46.69,4.9) v1(46.99,9.91)
VBUS: length 19
  Top Layer w0.254: U30.3 13.33,3.32 13.67,3.66 13.67,4.88 13.33,5.22 U30.1
  Top Layer w0.305: USB1.A4 8.64,12.05 v1(8.94,11.75) USB1.B9 ; USB1.A9 8.34,6.95 10.09,5.2 C51.2 8.42,7.25 USB1.B4
  Top Layer w0.5: 36.44,4.23 36.44,4.23 v1(35.7,4.23) ; 36.44,4.23 D11.1 ; 36.44,4.23 U31.6
  Top Layer w0.762: C51.2 12.6,5.2 U30.1
  vias: v1(9.35,6.15)
VINTA: length 5.1
  Top Layer w0.203: C56.2 30.18,8.93 30.18,7.86 29.66,7.35 U33.21
ANT: length 3.3
  Top Layer w0.254: U33.22 28.58,10.18 C57.1 28.61,11.42 28.58,11.44
ANT1: length 1.2
  Top Layer w0.254: L1.2 28.58,14.15 C58.1
BOOT: length 11.7
  Top Layer w0.203: v1(23.42,15.5) 23.42,16.16 R39.1 ; v1(23.42,12.34) 23.47,12.34 25.76,10.06 25.76,10.05 26.71,9.09 26.72,9.09 26.98,8.84 U33.26
  Top Layer w0.254: SW6.2 R39.1
  Bottom Layer w0.254: v1(23.42,12.34) v1(23.42,15.5)
D_SWCLK: length 61.5
  Top Layer w0.203: U33.10 26.98,3.2 v2(26.97,3.19) 26.97,3.11 27.13,2.95 27.45,2.95 27.91,2.49 38.3,2.49 38.54,2.25 v1(39.15,2.25) ; v1(18.24,13.82) 23.95,13.82 26.26,11.5 26.26,11.08 28.18,9.16 U33.23
  Top Layer w0.254: v1(38.83,13.93) 38.83,14.04 40.34,15.55 R48.1 ; v1(18.24,2.69) v1(18.24,10.82)
  Bottom Layer w0.203: v1(39.15,2.25) 39.15,3.27 38.83,3.59 v1(38.83,13.93)
  Bottom Layer w0.254: v1(18.24,2.69) 26.47,2.69 v2(26.97,3.19) ; v1(18.24,10.82) v1(18.24,13.82)
D_SWDIO: length 23
  Top Layer w0.203: U33.20 29.76,6.95 30.53,7.72 30.53,8.78 31.76,10.01 32.96,10.01 R45.1 32.91,8.43 31.45,8.43 31.24,8.23 31.24,7.42 29.97,6.15 U33.18
  Top Layer w0.254: R49.1 40.7,13.21 35.56,13.21 34.9,12.55 34.9,10.42 R45.1
LED_CON: length 26.4
  Top Layer w0.203: U33.17 30.44,5.75 v1(30.68,6) ; R54.2 15.34,16.51 15.34,15.44 16.05,14.73 24.84,14.73 26.06,13.51 v1(26.72,13.51)
  Bottom Layer w0.203: v1(30.68,6) 30.58,5.89 28.55,5.89 26.72,7.72 v1(26.72,13.51)
LED_MODE: length 23.3
  Top Layer w0.203: v1(29.41,4.37) 29.41,4.91 U33.15 ; v1(26.11,12.85) 24.59,14.38 15.82,14.38 R40.2
  Bottom Layer w0.203: v1(26.11,12.85) 26.11,7.67 v1(29.41,4.37)
MODES: length 5.9
  Top Layer w0.203: v2(26.21,3.29) 26.22,3.29 26.58,3.64 U33.9
  Top Layer w0.254: v1(22.86,3.29) 21.52,3.29 SW7.2
  Bottom Layer w0.254: v2(26.21,3.29) v1(22.86,3.29)
OSC_IN: length 4.6
  Top Layer w0.203: X1.3 24.9,6.95 U33.2
OSC_OUT: length 6.3
  Top Layer w0.203: U33.3 24.65,6.55 24.03,7.16 20.73,7.16 19.8,8.09 19.8,8.14
PA0: length 31.6
  Top Layer w0.203: v1(38.2,0.66) 36.22,0.66 35.87,1.02 27.37,1.02 26.91,1.47 26.32,1.47 26.07,1.72 25.34,1.72 24.08,2.97 24.08,5.03 24.8,5.75 U33.5
  Top Layer w0.254: U32.4 37.44,12.18
  Bottom Layer w0.203: v1(37.44,12.18) 38.2,11.41 v1(38.2,0.66)
PA1: length 23.8
  Top Layer w0.203: v1(37.34,1.22) 36.17,1.22 35.96,1.42 27.46,1.42 27.06,1.83 26.46,1.83 26.22,2.07 25.48,2.07 24.44,3.12 24.44,4.88 24.91,5.35 U33.6
  Top Layer w0.254: U31.4 v1(37.34,7.5)
  Bottom Layer w0.254: v1(37.34,1.22) v1(37.34,7.5)
PA6: length 24.3
  Top Layer w0.203: v1(40.1,10.06) 40.95,10.06 R50.1 ; v1(41.56,2.55) 41.26,2.85 28.05,2.85 27.38,3.52 27.38,4.14 U33.11
  Bottom Layer w0.203: v1(40.1,10.06) 40.1,5.37 41.56,3.91 v1(41.56,2.55)
PA7: length 24.9
  Top Layer w0.203: R51.1 41.84,8.03 43.79,8.03 44.25,7.57 44.25,3.76 43.69,3.2 28.2,3.2 27.77,3.63 U33.12
PA12: length 4.6
  Top Layer w0.203: U33.19 29.86,6.55 30.89,7.57 30.89,8.53 31.65,9.3 32.17,9.3 R45.2
RST: length 40.7
  Top Layer w0.203: v1(35.45,5.33) 35.44,5.35 U33.16
  Top Layer w0.254: v1(44.91,16.71) 40.79,16.71 37.9,13.82 v1(35.46,13.82) ; 47.85,3.56 45.98,3.56 44.91,4.62 v1(44.91,6.86)
  Bottom Layer w0.254: v1(35.45,5.33) 35.46,5.34 v1(35.46,13.82) ; v1(44.91,6.86) v1(44.91,16.71)
RX: length 5.5
  Top Layer w0.254: 47.85,13.72 47.37,14.2 R52.2
SWCLK/TCK: length 7
  Top Layer w0.254: R48.2 47.75,15.55 v1(47.8,15.5)
  Bottom Layer w0.254: v1(47.8,15.5) 47.8,13.72
SWDIO/TMS: length 6.6
  Top Layer w0.254: R49.2 45.92,12.85 46.48,12.29 v1(47.75,12.29)
  Bottom Layer w0.254: 47.8,11.18 47.75,11.23 v1(47.75,12.29)
TDI: length 6.4
  Top Layer w0.254: 47.85,6.1 46.79,6.1 44.07,8.81 R51.2
TDO: length 5.9
  Top Layer w0.254: R50.2 44.04,10.16 45.36,8.84 47.65,8.84 47.85,8.64
TX: length 5.4
  Top Layer w0.254: R53.2 47.52,11.51 47.85,11.18
UART2_RX: length 31
  Top Layer w0.203: v1(39.93,2.24) 39.93,1.83 39.73,1.63 38.76,1.63 38.56,1.83 38.25,1.83 37.95,2.13 27.76,2.13 27.35,2.54 26.76,2.54 26.52,2.78 25.78,2.78 25.35,3.21 25.35,3.91 25.58,4.15 U33.8
  Top Layer w0.254: R52.1 40.01,14.2 v1(39.95,14.15)
  Bottom Layer w0.203: v1(39.95,14.15) 39.19,13.38 39.19,4.4 39.93,3.66 v1(39.93,2.24)
UART2_TX: length 30.3
  Top Layer w0.203: U33.7 25.01,4.95 24.79,4.73 24.79,3.27 25.63,2.43 26.37,2.43 26.61,2.19 27.2,2.19 27.61,1.78 37.66,1.78 37.97,1.47 38.41,1.47 38.61,1.27 39.87,1.27 40.74,2.14 v1(40.74,2.19)
  Top Layer w0.254: v1(40.03,11.46) 40.08,11.51 R53.1
  Bottom Layer w0.203: v1(40.74,2.19) 40.74,4.01 39.54,5.21 39.54,10.97 v1(40.03,11.46)
USB_N: length 29.9
  Top Layer w0.203: USB1.A7 7.39,9.21 9.2,9.21 10.23,10.25 10.15,10.34 7.44,10.34 USB1.B7 ; D9.2 10.24,10.25 10.84,9.65 13.41,9.65 14.26,10.5 arc(14.33,10.67) 14.26,10.85 14.2,10.9 arc(14.2,11.26) 14.56,11.26 14.61,11.2 arc(14.96,11.2) 14.96,11.56 14.91,11.61 arc(14.91,11.97) 15.27,11.97 15.32,11.91 arc(15.49,11.84) 15.67,11.91 17.02,13.26 24,13.26 25.91,11.35 25.91,10.93 27.77,9.06 U33.24
USB_P: length 29.9
  Top Layer w0.203: v2(8.74,9.74) 8.73,9.75 USB1.A6 ; 27.38,8.15 27.38,8.96 25.55,10.78 25.55,11.21 23.86,12.9 17.17,12.9 15.68,11.42 arc(15.61,11.25) 15.68,11.07 15.99,10.76 arc(15.99,10.41) 15.64,10.41 15.33,10.71 arc(14.98,10.71) 14.98,10.36 15.29,10.05 arc(15.29,9.7) 14.93,9.7 14.62,10.01 arc(14.45,10.08) 14.27,10.01 13.56,9.3 10.91,9.3 D10.2 v2(8.74,8.65) 8.22,8.65 8.12,8.75 USB1.B6
  Bottom Layer w0.254: v2(8.74,9.74) v2(8.74,8.65)
$1N1782: length 1.6
  Top Layer w0.254: LED8.1 12.96,15.73 R40.1
$1N1786: length 1.5
  Top Layer w0.254: LED9.2 17.3,7.3 R41.2
$1N1849: length 2.9
  Top Layer w0.254: U31.5 35.61,6.55 35.2,6.15 R46.2
$1N1850: length 5.6
  Top Layer w0.254: R47.2 34.34,7.62 34.7,7.98 34.7,9.35 35.36,10.01 35.36,10.97 35.61,11.23 U32.5
$1N2678: length 1.6
  Top Layer w0.254: R54.1 12.91,17.32 12.4,17.32 12.34,17.38 LED10.1
$1N9716: length 3.2
  Top Layer w0.203: R9.2 9.68,7.75 USB1.B5
$1N9721: length 3.3
  Top Layer w0.203: R18.1 9.26,10.75 USB1.A5

## Copper pours and planes (outline as drawn; the poured copper is in the pictures)
3V3_IN on Top Layer: 14.4,7.88 16.47,7.88 16.47,4.8 14.4,4.8
3V3_IN on Inner2: 0.97,18.74 49.46,18.74 49.46,0.26 0.97,0.26
GND on Top Layer: -1.79,21.3 51.66,21.3 51.66,-1.45 -1.79,-1.45
GND on Bottom Layer: -1.07,20.58 51.05,20.58 51.05,-0.89 -1.07,-0.89
GND on Inner1: 0.97,18.74 49.46,18.74 49.46,0.26 0.97,0.26
VBUS on Inner2: 0.97,13.47 36.99,13.47 36.99,0.26 0.97,0.26

Small or netless copper shapes (teardrops, artwork), in the pictures only: 171 on Top Layer, 38 on Bottom Layer, 11 on Inner1

## Text on the board
Bottom Solder Mask Layer: WCH-LinkW-R0-1v3
Bottom Silkscreen Layer: 5V | 3V3 | GND | SWC | SWD
Document Layer: 二维码麻烦添加在PCB背面
Top Silkscreen Layer: RXD | RST | TXD | TDO | TDI | PWR | MODE | CON | ModeS | BOOT
